# Altium schematic sheet avbrd.SchDoc
size A4
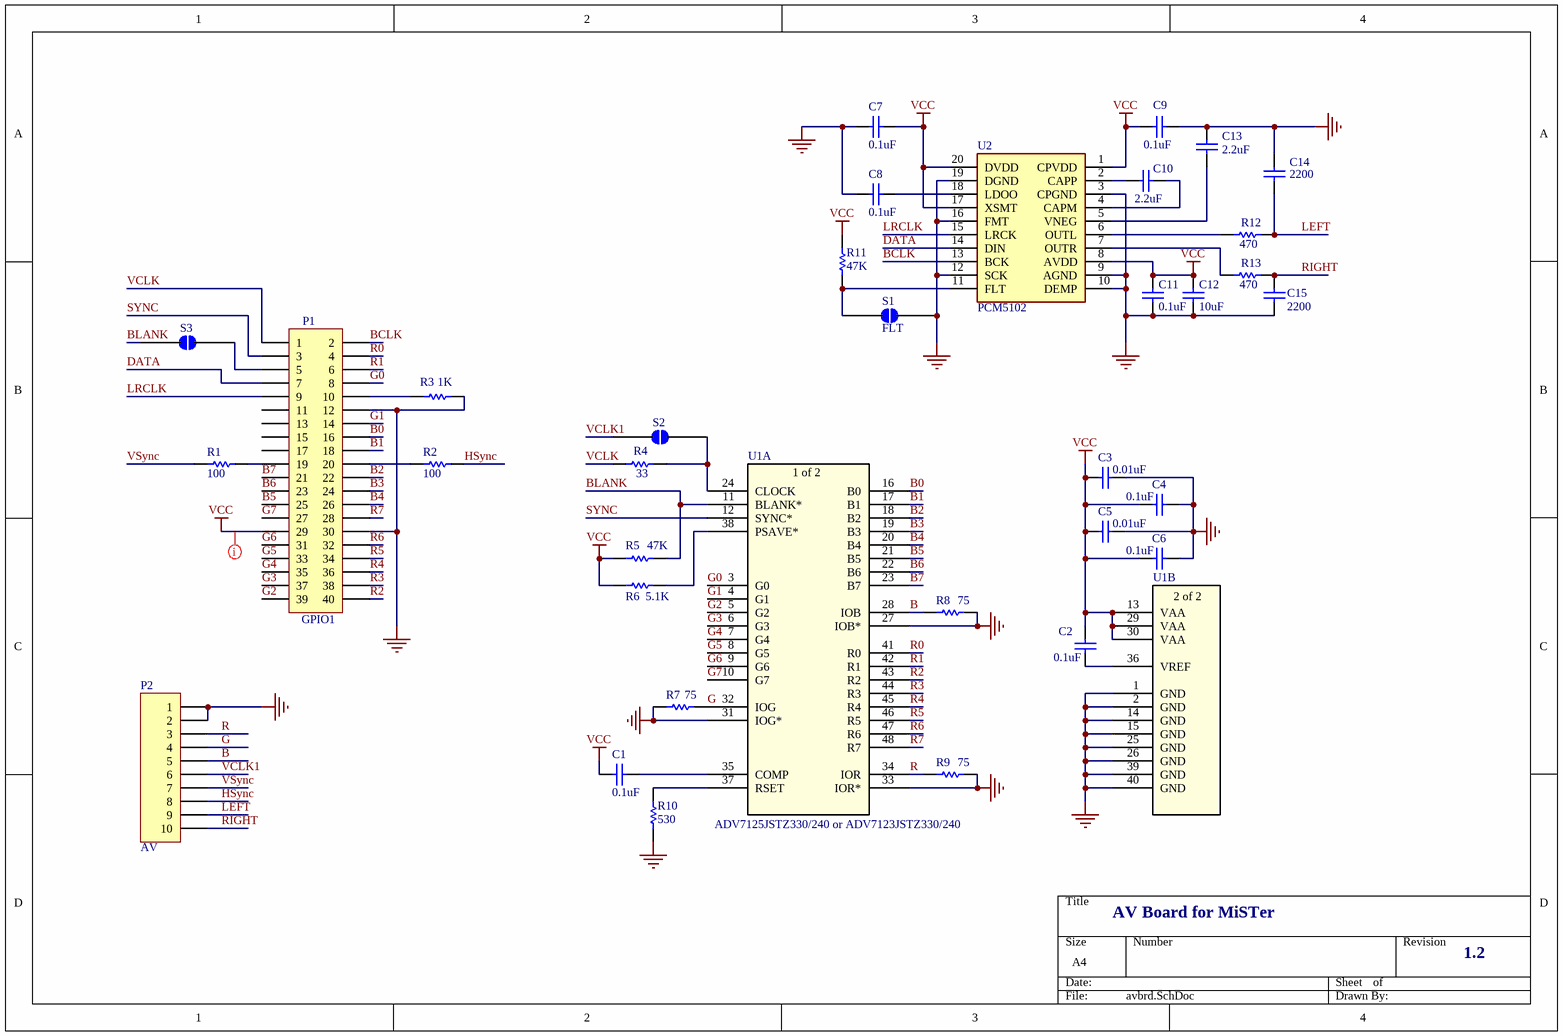
[diagram p0: avbrd.SchDoc]

## Parts
C1  value 0.1uF  [C0805]  (hidden comment: C0805)
C2  value 0.1uF  [C0805]  (hidden comment: C0805)
C3  value 0.01uF  [C0805]  (hidden comment: C0805)
C4  value 0.1uF  [C0805]  (hidden comment: C0805)
C5  value 0.01uF  [C0805]  (hidden comment: C0805)
C6  value 0.1uF  [C0805]  (hidden comment: C0805)
C7  value 0.1uF  [C0805]  (hidden comment: C0805)
C8  value 0.1uF  [C0805]  (hidden comment: C0805)
C9  value 0.1uF  [C0805]  (hidden comment: C0805)
C10  value 2.2uF  [C0805]  (hidden comment: C0805)
C11  value 0.1uF  [C0805]  (hidden comment: C0805)
C12  value 10uF  [C0805]  (hidden comment: C0805)
C13  value 2.2uF  [C0805]  (hidden comment: C0805)
C14  value 2200  [C0805]  (hidden comment: C0805)
C15  value 2200  [C0805]  (hidden comment: C0805)
P1  GPIO1  [HDR20x2_empty]
P2  AV  [HDR1X10]
R1  100  [R0805]
R2  100  [R0805]
R3  1K  [R0805]
R4  33  [R0805]
R5  47K  [R0805]
R6  5.1K  [R0805]
R7  75  [R0805]
R8  75  [R0805]
R9  75  [R0805]
R10  530  [R0805]
R11  47K  [R0805]
R12  470  [R0805]
R13  470  [R0805]
S1  FLT  [SEL]
S2  (no value)  [SEL]
S3  (no value)  [SEL]
U1  ADV7125JSTZ330/240 or ADV7123JSTZ330/240  [ST_48_ADI]  (parts A,B of 2)
U2  PCM5102  [SOP65P640X120-20N]

## Nets
GND: C3.1 C4.1 C5.1 C6.1 C7.1 C8.1 C9.2 C11.1 C12.1 C13.2 C14.1 C15.2 P1.12 P1.30 P2.1 P2.2 R3.1 R7.2 R8.2 R9.2 R10.1 S1.2 U1.1(GND) U1.2(GND) U1.14(GND) U1.15(GND) U1.25(GND) U1.26(GND) U1.27(IOB*) U1.31(IOG*) U1.33(IOR*) U1.39(GND) U1.40(GND) U2.3(CPGND) U2.9(AGND) U2.10(DEMP) U2.12(SCK) U2.16(FMT) U2.19(DGND)
VCC: C1.2 C2.1 C3.2 C4.2 C5.2 C6.2 C7.2 C9.1 C11.2 C12.2 P1.29 R5.2 R6.2 R11.2 U1.13(VAA) U1.29(VAA) U1.30(VAA) U2.1(CPVDD) U2.8(AVDD) U2.17(XSMT) U2.20(DVDD)
B: P2.5 R8.1 U1.28(IOB)
B0: P1.16 U1.16(B0)
B1: P1.18 U1.17(B1)
B2: P1.22 U1.18(B2)
B3: P1.24 U1.19(B3)
B4: P1.26 U1.20(B4)
B5: P1.25 U1.21(B5)
B6: P1.23 U1.22(B6)
B7: P1.21 U1.23(B7)
BCLK: P1.2 U2.13(BCK)
BLANK: R5.1 S3.2 U1.11(BLANK*)
DATA: P1.7 U2.14(DIN)
G: P2.4 R7.1 U1.32(IOG)
G0: P1.8 U1.3(G0)
G1: P1.14 U1.4(G1)
G2: P1.39 U1.5(G2)
G3: P1.37 U1.6(G3)
G4: P1.35 U1.7(G4)
G5: P1.33 U1.8(G5)
G6: P1.31 U1.9(G6)
G7: P1.27 U1.10(G7)
HSync: P2.8 R2.1
LEFT: C14.2 P2.9 R12.2
LRCLK: P1.9 U2.15(LRCK)
R: P2.3 R9.1 U1.34(IOR)
R0: P1.4 U1.41(R0)
R1: P1.6 U1.42(R1)
R2: P1.40 U1.43(R2)
R3: P1.38 U1.44(R3)
R4: P1.36 U1.45(R4)
R5: P1.34 U1.46(R5)
R6: P1.32 U1.47(R6)
R7: P1.28 U1.48(R7)
RIGHT: C15.1 P2.10 R13.2
SYNC: P1.3 U1.12(SYNC*)
VCLK: P1.1 R4.2
VCLK1: P2.6 S2.2
VSync: P2.7 R1.1
NetC1_1: C1.1 U1.35(COMP)
NetC2_2: C2.2 U1.36(VREF)
NetC8_2: C8.2 U2.18(LDOO)
NetC10_1: C10.1 U2.4(CAPM)
NetC10_2: C10.2 U2.2(CAPP)
NetC13_1: C13.1 U2.5(VNEG)
NetP1_5: P1.5 S3.1
NetP1_10: P1.10 R3.2
NetP1_19: P1.19 R1.2
NetP1_20: P1.20 R2.2
NetR4_1: R4.1 S2.1 U1.24(CLOCK)
NetR6_1: R6.1 U1.38(PSAVE*)
NetR10_2: R10.2 U1.37(RSET)
NetR11_1: R11.1 S1.1 U2.11(FLT)
NetR12_1: R12.1 U2.6(OUTL)
NetR13_1: R13.1 U2.7(OUTR)

Not connected (* = marked no-connect by the designer): P1 11 13 15 17

## Layout directives
net class power: VCC

## Notes on the sheet
- AV Board for MiSTer
- 1.2
- (in symbol ADV7125JSTZ330, part A) 1 of 2
- (in symbol ADV7125JSTZ330, part B) 2 of 2

## Library data of the parts
C1-C15 = C0805: Ceramic Chip Capacitor - Standard; Note: Footprint corresponds to dimensions for bulk cassette packaging. This case size has tightened tolerances.; Published: 17-Jul-2002; LatestRevisionDate: 19-Mar-2004; LatestRevisionNote: Silkscreen size reduced.; DatasheetDocument: Mar-2001; PackageDocument: Mar-2001; PackageReference: 0805; Publisher: Altium Limited; Code_JEITA: 0805; Code_IPC: 2012[0805]; ComponentLink1Description: Manufacturer Link; ComponentLink1URL: http://www.kemet.com/; ComponentLink2Description: Datasheet; ComponentLink2URL: http://www.kemet.com/kemet/web/homepage/kechome.nsf/vapubfilesname/F3102TA.pdf/$file/F3102TA.pdf
P1 = Header 20X2: Header, 20-Pin, Dual row; LatestRevisionDate: 17-Jul-2002; LatestRevisionNote: Re-released for DXP Platform.; Publisher: Altium Limited
P2 = Header 10: Header, 10-Pin; LatestRevisionDate: 17-Jul-2002; LatestRevisionNote: Re-released for DXP Platform.; Publisher: Altium Limited
R1-R13 = ERJ6RS: Low Ohmic Value Thick Film Chip Resistor, 0.1 Ohm to 0.2 Ohm Range, 1%, 2% and 5% Tolerance, 0805 Size, 0.125 W; Published: 17-Dec-2003; LatestRevisionDate: 19-Mar-2004; LatestRevisionNote: Silkscreen size reduced.; PackageDocument: Mar-2003; PackageReference: 6-0805; Publisher: Altium Limited; Code_IPC: 2012 [0805]; ComponentLink1Description: Manufacturer Link; ComponentLink1URL: http://www.panasonic.com/industrial/components/resistive_products.htm; ComponentLink2Description: Datasheet; ComponentLink2URL: http://www.panasonic.com/industrial/components/pdf/AOA0000CE3.pdf
S1-S3 = SEL
U1 = ADV7125JSTZ330: Mfr_Name: Analog Devices Inc; Copyright: Copyright (C) 2024 Ultra Librarian. All rights reserved.; Manufacturer_Part_Number: ADV7125JSTZ330; RefDes: RefDes; Type: DEV
U2 = PCM5102: Manufacturer_Name: Texas Instruments; Manufacturer_Part_Number: PCM5102PW; Geometry.Height: 1.2mm; Mouser Part Number: 595-PCM5102PW; Mouser Price/Stock: https://www.mouser.co.uk/ProductDetail/Texas-Instruments/PCM5102PW?qs=%252BG2H6gVb6ixUTg8gM%2FsSOw%3D%3D; Datasheet Link: http://www.ti.com/lit/ds/symlink/pcm5102.pdf